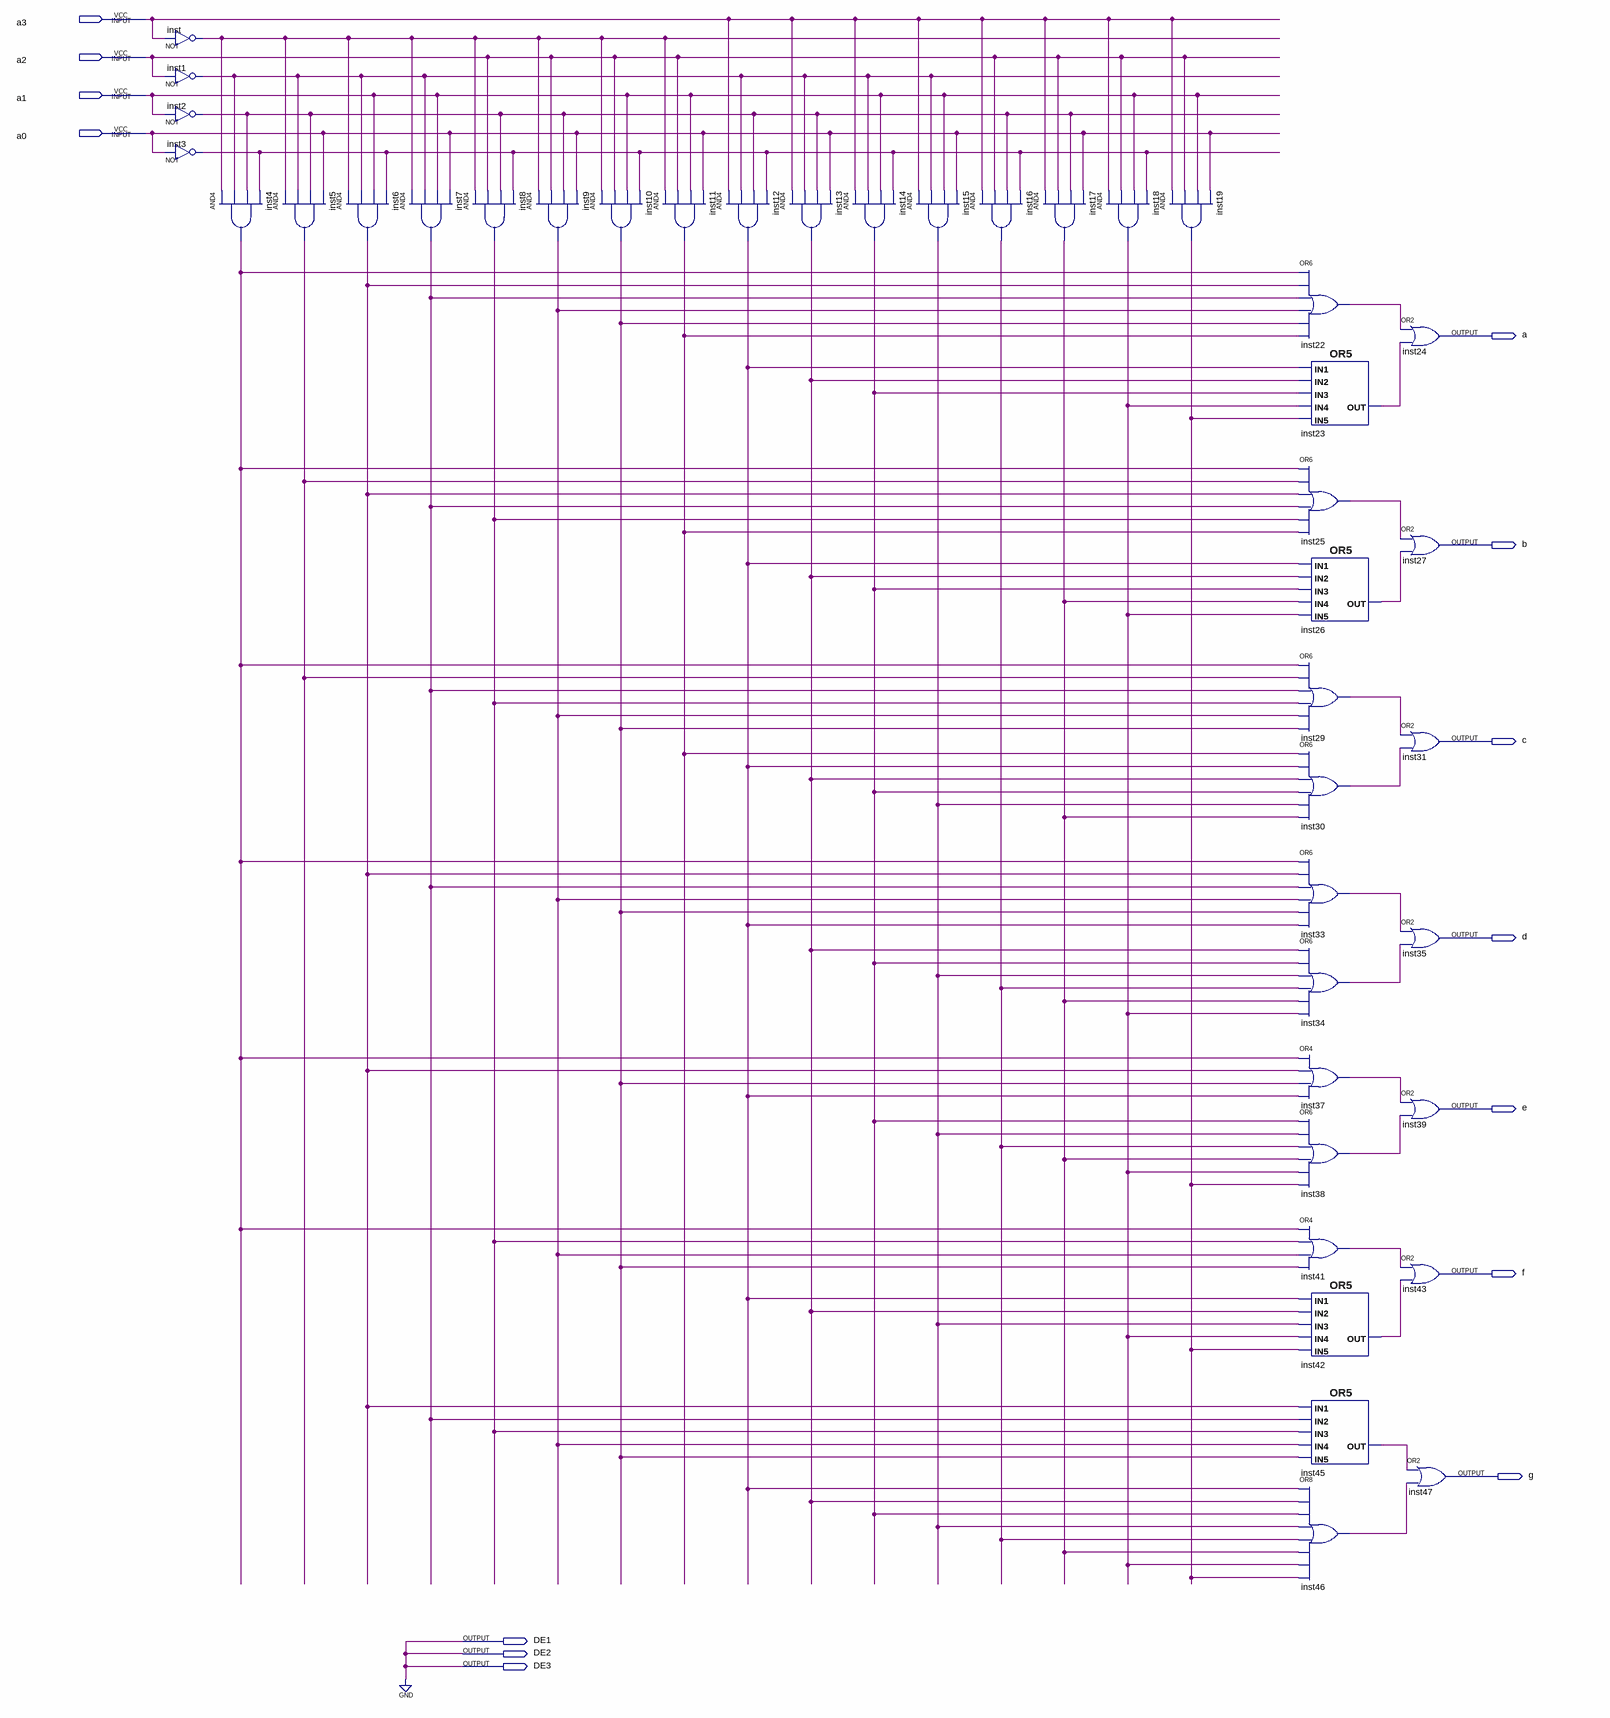
[diagram p0: schematic sheet]
// Quartus schematic sevenSegment.bdf as structural Verilog: 41 symbols, 14 pins
module sevenSegment (
  input  a3,
  input  a2,
  input  a1,
  input  a0,
  output a,
  output b,
  output c,
  output d,
  output e,
  output f,
  output g,
  output DE1,
  output DE2,
  output DE3
);

  wire inst1_out, inst2_out, inst3_out, inst4_out, inst5_out, inst6_out, inst7_out, inst8_out, inst9_out,
       inst10_out, inst11_out, inst12_out, inst13_out, inst14_out, inst15_out, inst16_out, inst17_out,
       inst18_out, inst19_out, inst22_out, inst23_out, inst25_out, inst26_out, inst29_out, inst30_out,
       inst33_out, inst34_out, inst37_out, inst38_out, inst41_out, inst42_out, inst45_out, inst46_out,
       inst_out;

  not inst (inst_out, a3);
  not inst1 (inst1_out, a2);
  not inst2 (inst2_out, a1);
  not inst3 (inst3_out, a0);
  and inst4 (inst4_out, inst_out, inst1_out, inst2_out, inst3_out);
  and inst5 (inst5_out, inst_out, inst1_out, inst2_out, a0);
  and inst6 (inst6_out, inst_out, inst1_out, a1, inst3_out);
  and inst7 (inst7_out, inst_out, inst1_out, a1, a0);
  and inst8 (inst8_out, inst_out, a2, inst2_out, inst3_out);
  and inst9 (inst9_out, inst_out, a2, inst2_out, a0);
  and inst10 (inst10_out, inst_out, a2, a1, inst3_out);
  and inst11 (inst11_out, inst_out, a2, a1, a0);
  and inst12 (inst12_out, a3, inst1_out, inst2_out, inst3_out);
  and inst13 (inst13_out, a3, inst1_out, inst2_out, a0);
  and inst14 (inst14_out, a3, inst1_out, a1, inst3_out);
  and inst15 (inst15_out, a3, inst1_out, a1, a0);
  and inst16 (inst16_out, a3, a2, inst2_out, inst3_out);
  and inst17 (inst17_out, a3, a2, inst2_out, a0);
  and inst18 (inst18_out, a3, a2, a1, inst3_out);
  and inst19 (inst19_out, a3, a2, a1, a0);
  or inst22 (inst22_out, inst4_out, inst6_out, inst7_out, inst9_out, inst10_out, inst11_out);
  or inst23 (inst23_out, inst12_out, inst13_out, inst14_out, inst18_out, inst19_out);
  or inst25 (inst25_out, inst4_out, inst5_out, inst6_out, inst7_out, inst8_out, inst11_out);
  or inst26 (inst26_out, inst12_out, inst13_out, inst14_out, inst17_out, inst18_out);
  or inst29 (inst29_out, inst4_out, inst5_out, inst7_out, inst8_out, inst9_out, inst10_out);
  or inst30 (inst30_out, inst11_out, inst12_out, inst13_out, inst14_out, inst15_out, inst17_out);
  or inst33 (inst33_out, inst4_out, inst6_out, inst7_out, inst9_out, inst10_out, inst12_out);
  or inst34 (inst34_out, inst13_out, inst14_out, inst15_out, inst16_out, inst17_out, inst18_out);
  or inst37 (inst37_out, inst4_out, inst6_out, inst10_out, inst12_out);
  or inst38 (inst38_out, inst14_out, inst15_out, inst16_out, inst17_out, inst18_out, inst19_out);
  or inst41 (inst41_out, inst4_out, inst8_out, inst9_out, inst10_out);
  or inst42 (inst42_out, inst12_out, inst13_out, inst15_out, inst18_out, inst19_out);
  or inst45 (inst45_out, inst6_out, inst7_out, inst8_out, inst9_out, inst10_out);
  or inst46 (inst46_out, inst12_out, inst13_out, inst14_out, inst15_out, inst16_out, inst17_out, inst18_out, inst19_out);
  or inst24 (a, inst22_out, inst23_out);
  or inst27 (b, inst25_out, inst26_out);
  or inst31 (c, inst29_out, inst30_out);
  or inst35 (d, inst33_out, inst34_out);
  or inst39 (e, inst37_out, inst38_out);
  or inst43 (f, inst41_out, inst42_out);
  or inst47 (g, inst45_out, inst46_out);

  assign DE1 = 1'b0;
  assign DE2 = 1'b0;
  assign DE3 = 1'b0;
endmodule
